# EAGLE design Syn-ShieldCarger-v04 (EAGLE 5.10)
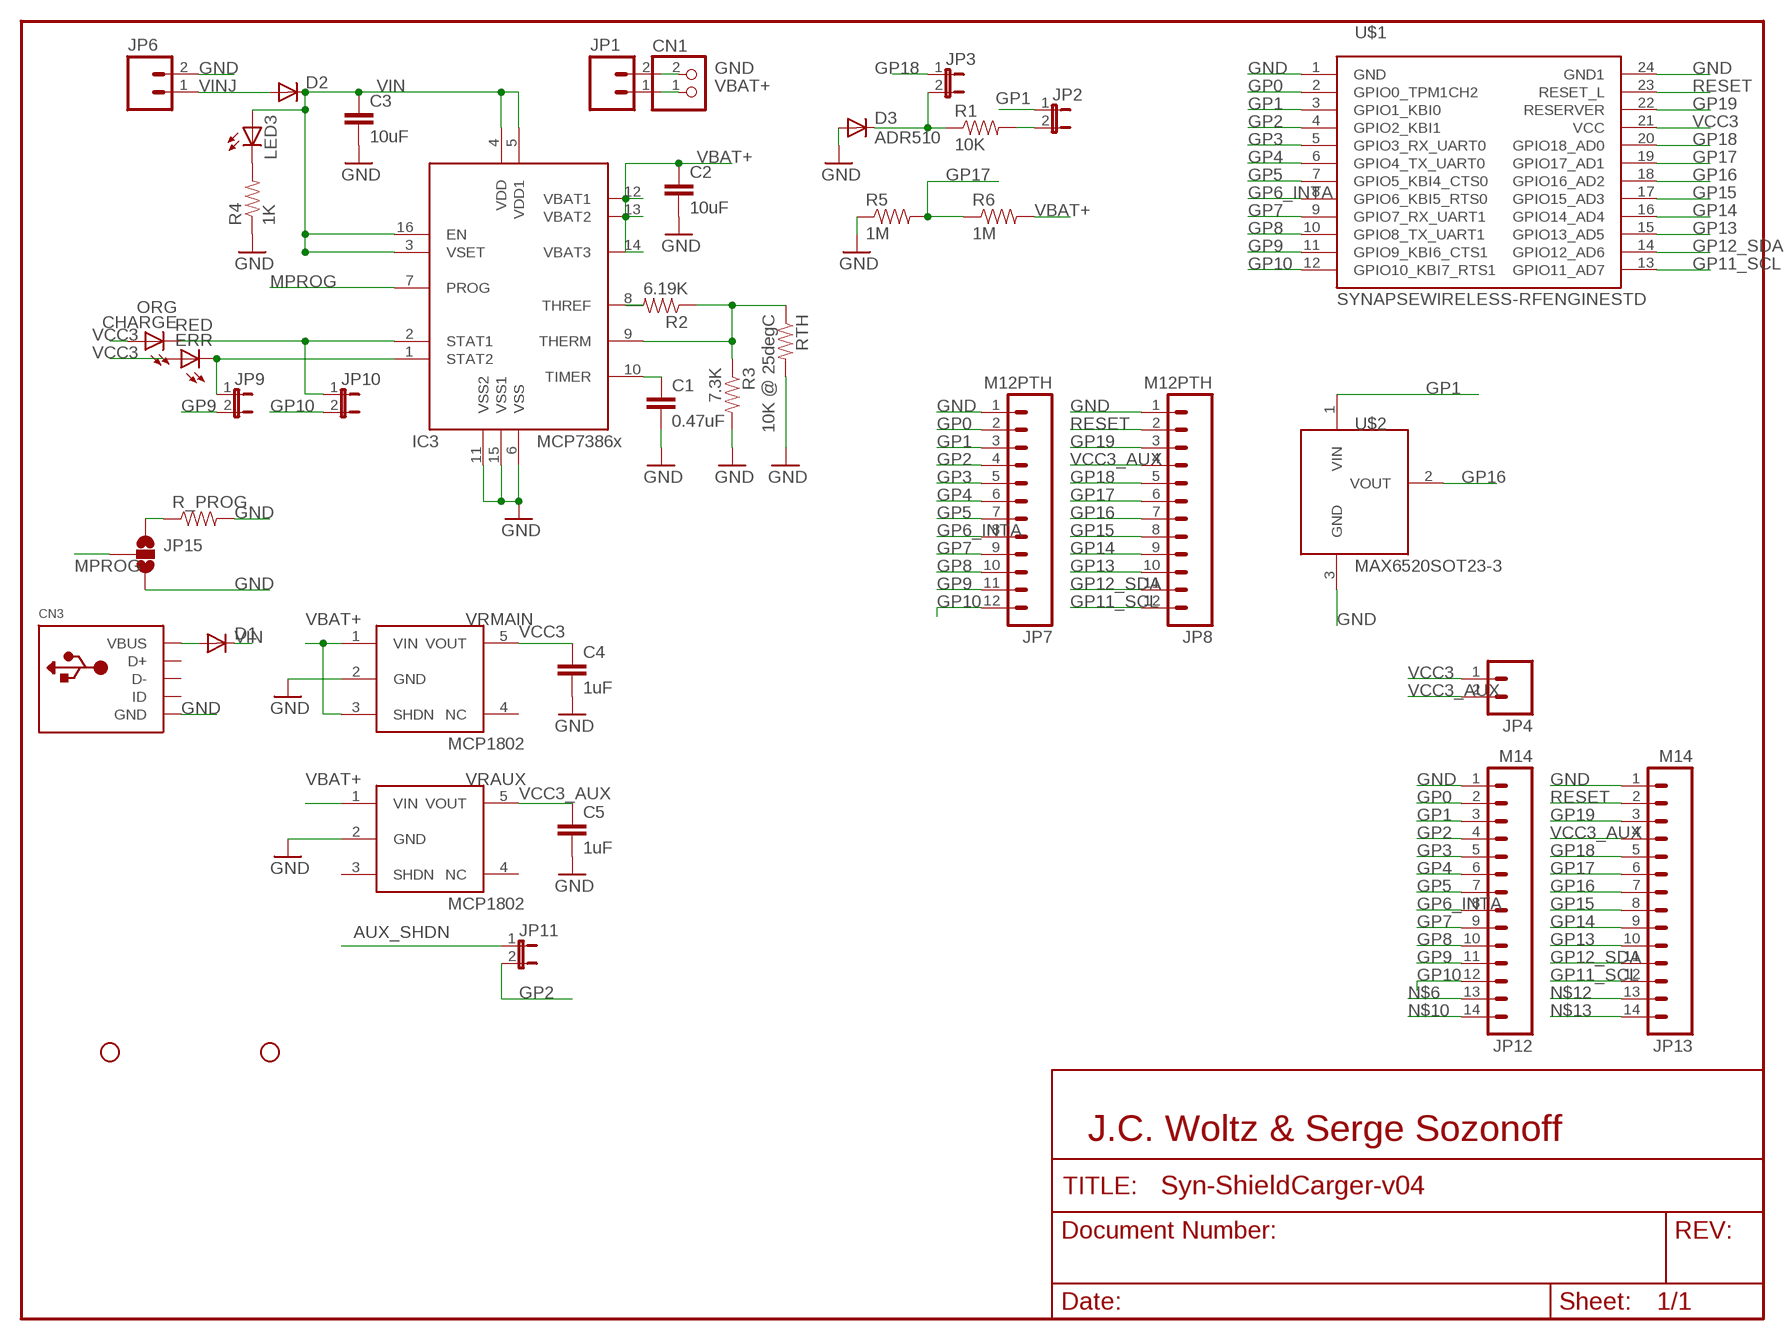
[diagram p0: schematic, sheet 1]

## Parts
C1  0.47uF  CAP0603-CAP  [0603-CAP]
C2  10uF  CAP1206  [1206]
C3  10uF  CAP1206  [1206]
C4  1uF  CAP0603-CAP  [0603-CAP]
C5  1uF  CAP0603-CAP  [0603-CAP]
CHARGE  ORG  LEDCHIPLED_0603  [CHIPLED_0603]
CN1  JST_2PIN-THM-RA  [JST-PH-2-THM-RA]
CN3  USBMINIB  [USB-MINIB]
D1  DIODESOD  [SOD-323]
D2  DIODESMA  [SMA-DIODE]
D3  ADR510  DIODESOT-23-3-ADR510  [SOT23-3]
ERR  RED  LEDCHIPLED_0603  [CHIPLED_0603]
IC3  MCP73861SO16  [SO16-150MIL]
JP1  M02PTH  [1X02]
JP2  JUMPER-2SMD-NC  [SJ_2S]
JP3  JUMPER-2SMD-NC  [SJ_2S]
JP4  M02PTH  [1X02]
JP5  STAND-OFF  [STAND-OFF]
JP6  M023.5MM  [SCREWTERMINAL-3.5MM-2]
JP7  M12PTH  [1X12]
JP8  M12PTH  [1X12]
JP9  JUMPER-2SMD-NC  [SJ_2S]
JP10  JUMPER-2SMD-NC  [SJ_2S]
JP11  JUMPER-2SMD-NC  [SJ_2S]
JP12  M14  [1X14]
JP13  M14  [1X14]
JP15  SOLDERJUMPER_2WAYT  [SJ_2]
JP17  STAND-OFF  [STAND-OFF]
LED3  LEDCHIPLED_0603  [CHIPLED_0603]
R1  10K  RESISTOR0603-RES  [0603-RES]
R2  6.19K  RESISTOR0603-RES  [0603-RES]
R3  7.3K  RESISTOR0603-RES  [0603-RES]
R4  1K  RESISTOR0603-RES  [0603-RES]
R5  1M  RESISTOR0603-RES  [0603-RES]
R6  1M  RESISTOR0603-RES  [0603-RES]
R_PROG  RESISTORAXIAL-0603  [AXIAL-0603]
RTH  10K @ 25degC  RESISTORAXIAL-0603  [AXIAL-0603]
U$1  SYNAPSEWIRELESS-RFENGINESTD  SYNAPSEWIRELESS-RFENGINESTDSTD  [SYNAPSERFENGINE]
U$2  MAX6520SOT23-3  [SOT23-3]
VRAUX  MCP1802  [SOT23-5]
VRMAIN  MCP1802  [SOT23-5]

## Nets
AUX_SHDN: JP11.1
GND: C1.2 C2.2 C3.2 C4.2 C5.2 CN1.2 CN3.GND D3.2(A) IC3.6(VSS) IC3.11(VSS2) IC3.15(VSS1) JP1.2 JP6.2 JP7.1 JP8.1 JP12.1 JP13.1 JP15.3 R3.2 R4.1 R5.1 R_PROG.P$2 RTH.P$2 U$1.1(GND) U$1.24(GND1) U$2.3(GND) VRAUX.2(GND) VRMAIN.2(GND)
GP0: JP7.2 JP12.2 U$1.2(GPIO0_TPM1CH2)
GP1: JP2.1 JP7.3 JP12.3 U$1.3(GPIO1_KBI0) U$2.1(VIN)
GP2: JP7.4 JP11.2 JP12.4 U$1.4(GPIO2_KBI1)
GP3: JP7.5 JP12.5 U$1.5(GPIO3_RX_UART0)
GP4: JP7.6 JP12.6 U$1.6(GPIO4_TX_UART0)
GP5: JP7.7 JP12.7 U$1.7(GPIO5_KBI4_CTS0)
GP6_INTA: JP7.8 JP12.8 U$1.8(GPIO6_KBI5_RTS0)
GP7: JP7.9 JP12.9 U$1.9(GPIO7_RX_UART1)
GP8: JP7.10 JP12.10 U$1.10(GPIO8_TX_UART1)
GP9: JP7.11 JP9.2 JP12.11 U$1.11(GPIO9_KBI6_CTS1)
GP10: JP7.12 JP10.2 JP12.12 U$1.12(GPIO10_KBI7_RTS1)
GP11_SCL: JP8.12 JP13.12 U$1.13(GPIO11_AD7)
GP12_SDA: JP8.11 JP13.11 U$1.14(GPIO12_AD6)
GP13: JP8.10 JP13.10 U$1.15(GPIO13_AD5)
GP14: JP8.9 JP13.9 U$1.16(GPIO14_AD4)
GP15: JP8.8 JP13.8 U$1.17(GPIO15_AD3)
GP16: JP8.7 JP13.7 U$1.18(GPIO16_AD2) U$2.2(VOUT)
GP17: JP8.6 JP13.6 R5.2 R6.1 U$1.19(GPIO17_AD1)
GP18: JP3.1 JP8.5 JP13.5 U$1.20(GPIO18_AD0)
GP19: JP8.3 JP13.3 U$1.22(RESERVER)
MPROG: IC3.7(PROG) JP15.2
N$2: LED3.C R4.2
N$3: D3.1(C) JP3.2 R1.1
N$4: JP2.2 R1.2
N$6: JP12.13
N$7: IC3.8(THREF) R2.2
N$8: IC3.9(THERM) R2.1 R3.1 RTH.P$1
N$9: C1.1 IC3.10(TIMER)
N$10: JP12.14
N$11: JP15.1 R_PROG.P$1
N$12: JP13.13
N$13: JP13.14
N$21: CN3.VBUS D1.2(A)
RESET: JP8.2 JP13.2 U$1.23(RESET_L)
STAT1: CHARGE.C IC3.2(STAT1) JP10.1
STAT2: ERR.C IC3.1(STAT2) JP9.1
VBAT+: C2.1 CN1.1 IC3.12(VBAT1) IC3.13(VBAT2) IC3.14(VBAT3) JP1.1 R6.2 VRAUX.1(VIN) VRMAIN.1(VIN) VRMAIN.3(SHDN)
VCC3: C4.1 CHARGE.A ERR.A JP4.1 U$1.21(VCC) VRMAIN.5(VOUT)
VCC3_AUX: C5.1 JP4.2 JP8.4 JP13.4 VRAUX.5(VOUT)
VIN: C3.1 D1.1(C) D2.C IC3.3(VSET) IC3.4(VDD) IC3.5(VDD1) IC3.16(EN) LED3.A
VINJ: D2.A JP6.1
Unconnected: CN3.D+ CN3.D- CN3.ID VRAUX.3(SHDN) VRAUX.4(NC) VRMAIN.4(NC)

## Notes on the sheet
- J.C. Woltz & Serge Sozonoff

## Library data of the parts
C1-C5 = SparkFun:CAP: Capacitor Standard 0603 ceramic capacitor, and 0.1" leaded capacitor.
CHARGE ERR LED3 = adafruit:LED: LED OSRAM: - CHIPLED LG R971, LG N971, LY N971, LG Q971, LY Q971, LO R971, LY R971 LH N974, LH R974 LS Q976, LO Q976, LY Q976 LO Q996 - Hyper CHIPLED LW Q18S LB Q993, LB Q99A, LB R99A - SideLED LS A670, LO A670, LY A670, LG A670, LP A670 LB A673, LV A673, LT A673, LW A673 LH A674 LY A675 LS A676, LA A676, LO A676, LY A676, LW A676 LS A679, LY A679, LG A679 - Hyper Micro SIDELED® LS Y876, LA Y876, LO Y876, LY Y876 LT Y87S - SmartLED LW L88C, LW L88S LB L89C, LB L89S, LG L890 LS L89K, LO L89K, LY L89K LS L896, LA L896, LO L896, LY L896 - TOPLED LS T670, LO T670, LY T670, LG T670, LP T670 LSG T670, LSP T670, LSY T670, LOP T670, LYG T670 LG T671, LOG T671, LSG T671 LB T673, LV T673, LT T673, LW T673 LH T674 LS T676, LA T676, LO T676, LY T676, LB T676, LH T676, LSB T676, LW T676 LB T67C, LV T67C, LT T67C, LS T67K, LO T67K, LY T67K, LW E67C LS E67B, LA E67B, LO E67B, LY E67B, LB E67C, LV E67C, LT E67C LW T67C LS T679, LY T679, LG T679 LS T770, LO T770, LY T770, LG T770, LP T770 LB T773, LV T773, LT T773, LW T773 LH T774 LS E675, LA E675, LY E675, LS T675 LS T776, LA T776, LO T776, LY T776, LB T776 LHGB T686 LT T68C, LB T68C - Hyper Mini TOPLED® LB M676 - Mini TOPLED Santana® LG M470 LS M47K, LO M47K, LY M47K Source: http://www.osram.convergy.de/
CN1 = adafruit:JST_2PIN: JST 2-Pin Connectors of various flavors SMT-RA (S2B-PH-SM4) 4UConnector #17311 SMT (B2B-PH-SM4) THM-RA (S2B-PH) THM (B2B-PH)
CN3 = adafruit:USB: USB Connectors USBMINIB - Surface Mount Female Mini-B USB Connector 4UConnector: 06564 By microbuilder.eu Thru-hole RA Female Mini-B USB Connector 4UConnector: 18732 By ladyada.net
D1 D2 = SparkFun:DIODE: Diode These are standard reverse protection diodes and small signal diodes. SMA package can handle up to about 1A. SOD-323 can handle about 200mA. What the SOD-323 package when ordering, there are some mfgs out there that are 5-pin packages.
D3 = 0_jc-modified:DIODE: Diode These are standard reverse protection diodes and small signal diodes. SMA package can handle up to about 1A. SOD-323 can handle about 200mA. What the SOD-323 package when ordering, there are some mfgs out there that are 5-pin packages.
IC3 = 0_jc-custom:MCP73861
JP1 JP4 JP6 = SparkFun:M02: Header 2 Standard 2-pin 0.1" header. Use with straight break away headers (SKU : PRT-00116), right angle break away headers (PRT-00553), swiss pins (PRT-00743), machine pins (PRT-00117), and female headers (PRT-00115). Molex polarized connector foot print use with SKU : PRT-08233 with associated crimp pins and housings.
JP2 JP3 JP9-JP11 = SparkFun:JUMPER-2: Jumper Basic 0.1" spaced jumper. Use with breakaway headers.
JP5 JP17 = SparkFun:STAND-OFF: Stand Off This is the mechanical footprint for a #4 phillips button head screw. Use the keepout ring to avoid running the screw head into surrounding components. SKU : PRT-00447
JP7 JP8 = SparkFun:M12: Header 12 Standard 12-pin 0.1" header. Use with straight break away headers (SKU : PRT-00116), right angle break away headers (PRT-00553), swiss pins (PRT-00743), machine pins (PRT-00117), and female headers (PRT-00115).
JP12 JP13 = SparkFun:M14: Header 14 Standard 14-pin 0.1" header. Use with straight break away headers (SKU : PRT-00116), right angle break away headers (PRT-00553), swiss pins (PRT-00743), machine pins (PRT-00117), and female headers (PRT-00115).
JP15 = SparkFun:SOLDERJUMPER_2WAY: Solder Jumper 2 way solder jumper
R1 R4-R6 = SparkFun:RESISTOR: Resistor Basic schematic elements and footprints for 0603, 1206, and PTH 1/10th watt (small) resistors.
R2 R3 R_PROG RTH = 0_jc-custom:RESISTOR
U$1 = 0_jc-custom:SYNAPSEWIRELESS-RFENGINE
U$2 = 0_jc-custom:MAX6520
VRAUX VRMAIN = 0_jc-modified:MCP1802

## Board
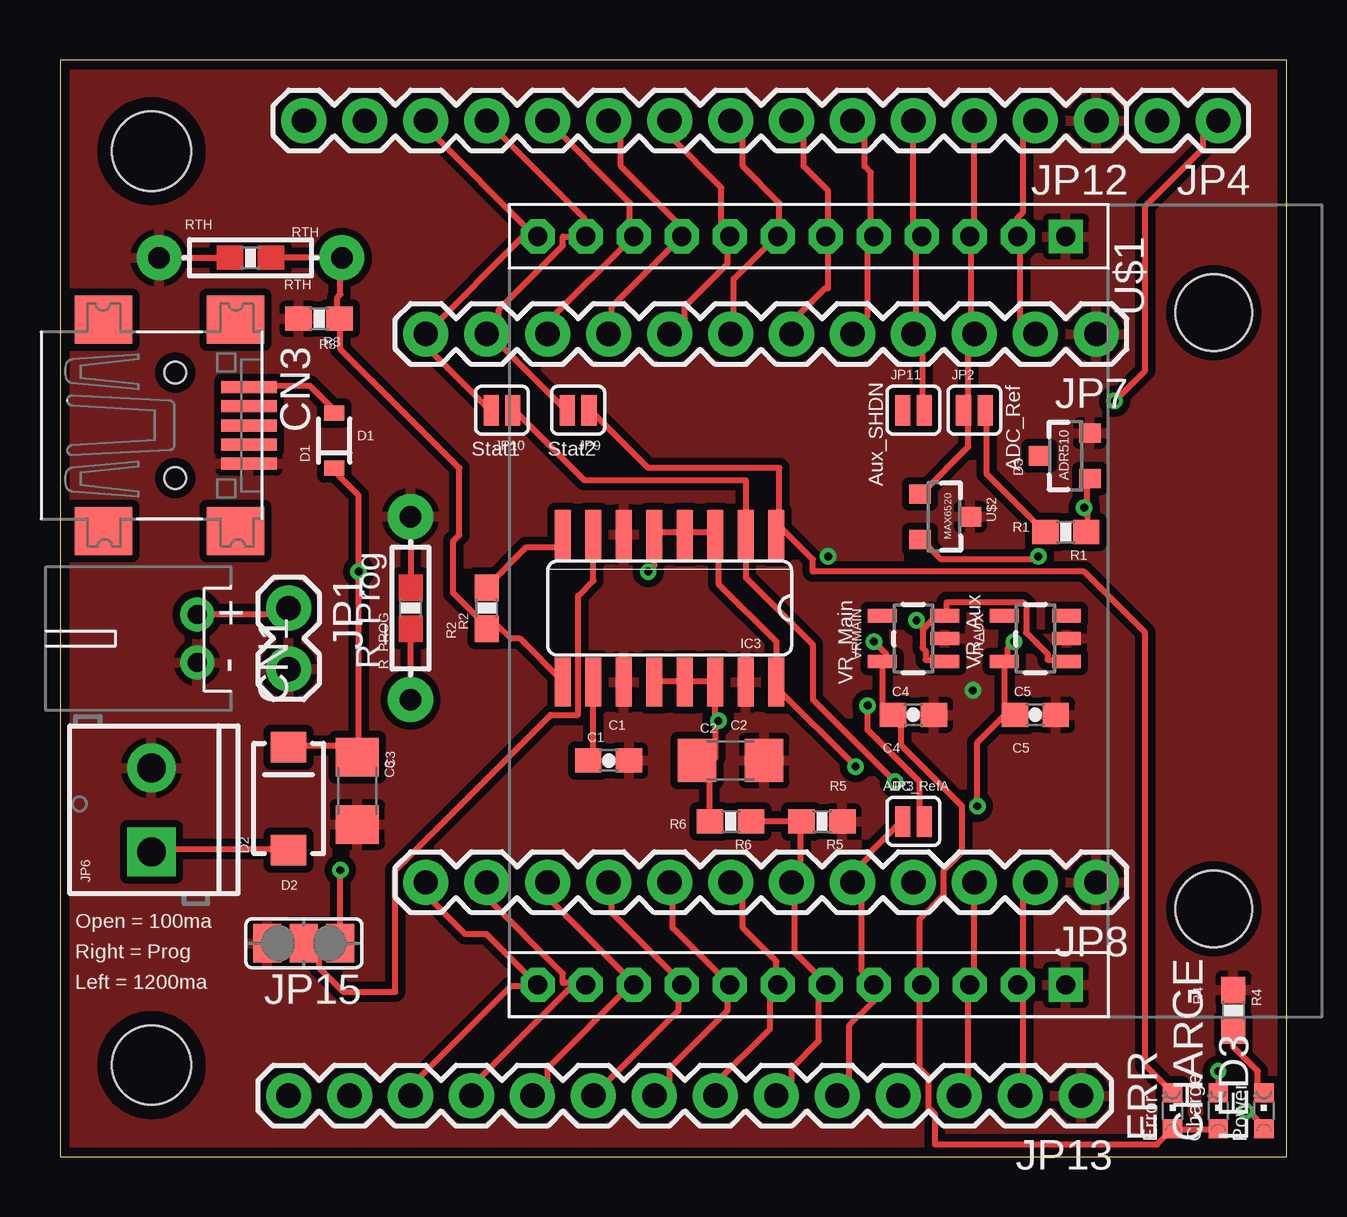
[diagram p1: board, top side]
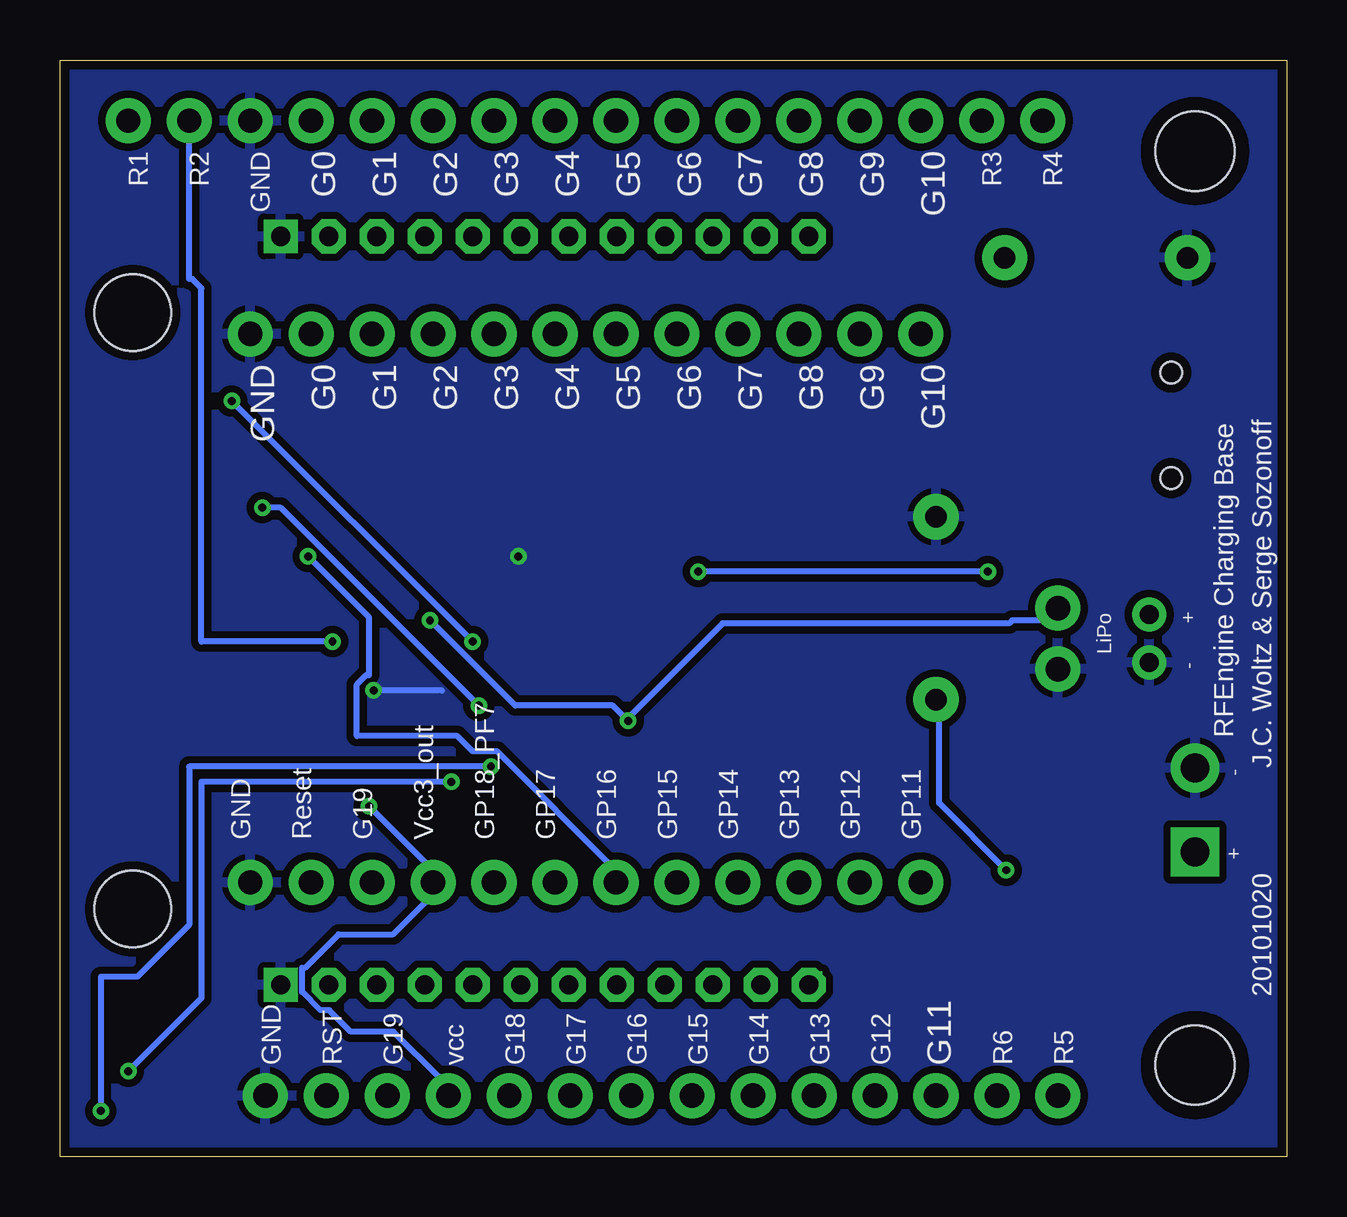
[diagram p2: board, bottom side, seen from below]

Size 51.1 x 45.71 mm. Coordinates in mm from the lower left corner, seen from the top.
Outline: 0,0 51.1,0 51.1,45.71 0,45.71 0,0
Copper layers (1*16): Top 0.0356mm / dielectric 1.5011mm / Bottom 0.0356mm
Design rules "LaenPCBOrder-JCModified": minimum track width 10mil, minimum drill 13mil, track to track 10mil, track to pad 6mil, pad to pad 6mil, via to via 6mil, smd to smd 6mil, copper to edge 15mil, drill to drill 6mil, minimum pad ring 12mil, minimum via ring 7mil, stop-mask expansion 4mil, vias tented up to drill 25mil, thermal gap 10mil

### Footprints (pad centres in the part's own frame; a part is rotated, then mirrored left to right if it is on the bottom)
0603-CAP = smd 1.1 x 1: 1 -0.85,0; 2 0.85,0
1206 = smd 1.6 x 1.8: 1 -1.4,0; 2 1.4,0
CHIPLED_0603 = smd 0.8 x 0.8: A 0,-0.75; C 0,0.75
JST-PH-2-THM-RA = drill 0.8 pad 1.422 round: 1 1,0; 2 -1,0
USB-MINIB = smd 0.5 x 2.308: D+ 0,4.064; D- -0.8,4.064; GND 1.6,4.064; ID 0.8,4.064; VBUS -1.6,4.064 | smd 2 x 2.4: GND1 -4.4,-2; GND2 -4.4,3.5; GND3 4.4,3.5; GND4 4.4,-2 | hole 0.9: -2.2,1; 2.2,1
SOD-323 = smd 0.63 x 0.83: 1 -1.15,0; 2 1.15,0
SMA-DIODE = smd 1.27 x 1.47: A -2.15,0; C 2.15,0
SOT23-3 = smd 0.8 x 0.9: 1 -0.95,-1; 2 0.95,-1; 3 0,1.1
SO16-150MIL = smd 0.66 x 2.032: 1 -4.445,-3.073; 2 -3.175,-3.073; 3 -1.905,-3.073; 4 -0.635,-3.073; 5 0.635,-3.073; 6 1.905,-3.073; 7 3.175,-3.073; 8 4.445,-3.073; 9 4.445,3.073; 10 3.175,3.073; 11 1.905,3.073; 12 0.635,3.073; 13 -0.635,3.073; 14 -1.905,3.073; 15 -3.175,3.073; 16 -4.445,3.073
1X02 = drill 1.016 pad 1.88 round: 1 0,0; 2 2.54,0
SJ_2S = smd 0.635 x 1.27: 1 -0.45,0; 2 0.45,0
STAND-OFF = hole 3.302: 0,0
SCREWTERMINAL-3.5MM-2 = drill 1.2 pad 2.032 square: 1 0,0 | drill 1.2 pad 2.032 round: 2 3.5,0
1X12 = drill 1.016 pad 1.88 round: 1 0,0; 2 2.54,0; 3 5.08,0; 4 7.62,0; 5 10.16,0; 6 12.7,0; 7 15.24,0; 8 17.78,0; 9 20.32,0; 10 22.86,0; 11 25.4,0; 12 27.94,0
1X14 = drill 1.016 pad 1.88 round: 1 0,0; 2 2.54,0; 3 5.08,0; 4 7.62,0; 5 10.16,0; 6 12.7,0; 7 15.24,0; 8 17.78,0; 9 20.32,0; 10 22.86,0; 11 25.4,0; 12 27.94,0; 13 30.48,0; 14 33.02,0
SJ_2 = smd 1.168 x 1.6: 1 -1.524,0; 2 0,0; 3 1.524,0
0603-RES = smd 1.1 x 1: 1 -0.85,0; 2 0.85,0
AXIAL-0603 = drill 0.9 pad 1.88 round: P$1 -3.81,0; P$2 3.81,0
SYNAPSERFENGINE = drill 0.8 square: 1 0,0; 24 31.2,0 | drill 0.8 pad 1.422 octagon: 2 0,-2; 3 0,-4; 4 0,-6; 5 0,-8; 6 0,-10; 7 0,-12; 8 0,-14; 9 0,-16; 10 0,-18; 11 0,-20; 12 0,-22; 13 31.2,-22; 14 31.2,-20; 15 31.2,-18; 16 31.2,-16; 17 31.2,-14; 18 31.2,-12; 19 31.2,-10; 20 31.2,-8; 21 31.2,-6; 22 31.2,-4; 23 31.2,-2 | hole 3.2: 3.17,6.16; 28.03,6.16
SOT23-5 = smd 0.55 x 1.2: 1 -0.95,-1.3; 2 0,-1.3; 3 0.95,-1.3; 4 0.95,1.3; 5 -0.95,1.3

### Placement (x,y rotation side)
C1  22.86,16.51 0 top
C2  27.94,16.51 0 top
C3  12.38,15.24 270 top
C4  35.56,18.41 0 top
C5  40.64,18.41 0 top
CHARGE  48.26,1.91 0 top
CN1  5.71,21.59 90 top
CN3  3.81,30.48 270 top
D1  11.43,29.84 90 top
D2  9.53,14.92 90 top
D3  41.91,29.21 90 top
ERR  46.35,1.91 0 top
IC3  25.4,22.86 180 top
JP1  9.53,22.86 270 top
JP2  38.1,31.11 0 top
JP3  35.56,13.97 0 top
JP4  48.26,43.18 180 top
JP5  3.81,41.91 0 top
JP6  3.81,12.7 90 top
JP7  43.18,34.29 180 top
JP8  43.18,11.43 180 top
JP9  21.59,31.11 180 top
JP10  18.41,31.11 180 top
JP11  35.56,31.11 0 top
JP12  43.18,43.18 180 top
JP13  42.55,2.54 180 top
JP15  10.16,8.89 180 top
JP17  3.81,3.81 0 top
LED3  50.16,1.91 0 top
R1  41.91,26.04 180 top
R2  17.78,22.86 90 top
R3  10.79,34.92 180 top
R4  48.9,6.1 270 top
R5  31.75,13.97 180 top
R6  27.94,13.97 180 top
R_PROG  14.61,22.86 90 top
RTH  7.94,37.47 180 top
U$1  41.91,38.35 270 top
U$2  36.83,26.67 270 top
VRAUX  40.64,21.59 90 top
VRMAIN  35.56,21.59 90 top

### Tracks (layer width: path | path; a pad name or v marks a point on that pad's centre or on a via)
GND  (via drill 0.33)
  Bottom 0.254: 35.18,19.43 v38.04,19.43
  other vias: 32,25.02
  pour Bottom (isolate 0.305): 0,45.72 50.8,45.72 50.8,0 0,0
  pour Top (isolate 0.305): 0,45.72 50.8,45.72 50.8,0 0,0
GP0
  Top 0.254: JP7.2 40.01,34.29 40.01,38.35 U$1.2 39.88,38.35 39.88,39.12 40.13,39.37 40.13,42.67 JP12.2
GP1
  Top 0.254: JP12.3 38.1,38.35 U$1.3 37.97,38.35 37.97,34.29 JP7.3 37.85,34.04 37.85,31.24 37.72,31.11 JP2.1 37.85,31.11 37.85,29.59 35.94,27.69 U$2.1
GP2
  Top 0.254: JP11.2 35.94,31.11 35.94,33.4 35.56,33.78 JP7.4 35.69,33.78 35.69,38.23 35.81,38.35 U$1.4 35.56,38.35 JP12.4
GP3
  Top 0.254: JP7.5 33.02,34.42 33.66,35.05 33.66,38.1 U$1.5 33.78,38.35 33.78,41.02 33.53,41.27 33.53,42.67 JP12.5
GP4
  Top 0.254: 32,38.35 32,36.2 31.88,36.2 30.48,34.8 JP7.6 | JP12.6 30.99,42.67 30.99,41.27 32,40.26 32,38.35 | 32,38.35 U$1.6
GP5
  Top 0.254: JP7.7 28.07,34.42 28.07,36.58 29.84,38.35 U$1.7 29.97,38.35 29.97,39.75 28.45,41.27 28.45,42.67 JP12.7
GP6_INTA
  Top 0.254: 27.81,38.35 27.56,38.61 27.56,40.39 25.4,42.55 JP12.8 | JP7.8 26.04,34.92 26.04,35.43 27.81,37.21 27.81,38.35 | 27.81,38.35 U$1.8
GP7
  Top 0.254: JP7.9 22.99,34.42 22.99,35.43 U$1.9 25.78,38.35 25.78,38.86 23.37,41.27 23.37,42.67 JP12.9
GP8
  Top 0.254: JP7.10 20.32,34.8 23.88,38.35 U$1.10 23.75,38.35 23.75,39.75 JP12.10
GP9
  Top 0.254: JP9.2 21.08,31.11 17.91,34.29 JP7.11 18.29,34.04 18.29,35.31 20.95,37.97 20.95,38.35 21.84,38.35 | JP12.11 21.84,39.12 21.84,38.35 | 21.84,38.35 U$1.11
GP10
  Top 0.254: JP10.2 17.91,31.11 15.24,33.78 JP7.12 19.43,38.48 19.43,38.61 U$1.12 19.81,38.35 15.24,42.93 JP12.12
GP11_SCL  (via drill 0.6)
  Top 0.254: v19.81,7.24 17.78,9.27 16.89,9.27 15.24,10.92 JP8.12 | JP13.12 14.61,3.3 14.99,3.3 18.8,7.11 19.81,7.11 U$1.13
  Bottom 0.254: U$1.13 v19.81,7.24
GP12_SDA
  Top 0.254: JP8.11 17.78,10.79 20.95,7.62 20.95,7.24 21.84,7.24 U$1.14 21.84,7.11 21.34,7.11 17.53,3.3 17.14,3.3 JP13.11
GP13
  Top 0.254: JP8.10 20.32,10.79 23.88,7.24 U$1.15 23.75,7.24 23.75,7.11 20.32,3.68 20.32,3.17 JP13.10
GP14
  Top 0.254: JP8.9 22.99,11.3 22.99,10.16 25.91,7.24 U$1.16 25.78,7.24 25.78,6.1 JP13.9
GP15
  Top 0.254: JP8.8 25.53,11.3 25.53,9.53 27.81,7.24 U$1.17 27.81,7.11 27.81,6.1 25.4,3.68 25.4,3.17 JP13.8
GP16  (via drill 0.33)
  Top 0.254: JP13.7 27.3,3.05 29.59,5.33 29.59,6.86 29.84,7.11 U$1.18 29.84,7.24 29.84,8.13 28.45,9.53 28.45,10.92 JP8.7 | v40.77,25.02 40.77,24.89 36.7,24.89 35.94,25.65 U$2.2
  Bottom 0.254: v40.77,25.02 38.23,22.48 38.23,20.07 38.35,20.07 38.73,19.68 38.73,17.53 34.54,17.53 33.91,16.89 32.89,16.89 27.94,11.94 JP8.7
GP17
  Top 0.254: 30.86,13.97 R6.1 | 30.86,13.97 30.86,12.32 30.48,11.94 JP8.6 30.61,11.94 30.61,8.51 31.88,7.24 U$1.19 31.62,7.37 31.62,4.83 30.48,3.68 30.48,3.17 JP13.6 | 30.86,13.97 R5.2
GP18
  Top 0.254: JP3.1 35.05,13.97 33.78,12.7 33.78,12.57 33.02,11.81 JP8.5 33.4,12.06 33.4,7.75 33.91,7.24 U$1.20 33.91,7.11 33.91,6.48 32.89,5.46 32.89,3.05 JP13.5
GP19
  Top 0.254: JP8.3 38.1,7.37 37.97,7.24 U$1.22 37.85,7.11 37.85,2.92 JP13.3
MPROG
  Top 0.254: JP15.2 10.79,8.26 10.79,7.87 11.81,6.86 13.97,6.86 13.97,11.94 20.45,18.41 21.59,18.41 21.59,23.37 22.23,24 IC3.7
N$2
  Top 0.254: LED3.C 49.91,2.92 49.91,3.56 48.9,4.57 R4.2
N$3  (via drill 0.33)
  Top 0.254: 42.8,27.05 42.8,26.04 R1.1 | 42.8,27.05 42.8,28.19 D3.1 | v33.66,18.8 33.66,17.78 35.81,15.62 35.81,14.1 35.94,13.97 JP3.2 | v42.67,27.05 42.8,27.05
  Bottom 0.254: v33.66,18.8 41.91,27.05 v42.67,27.05
N$4
  Top 0.254: R1.2 41.02,26.04 38.61,28.45 38.61,31.11 JP2.2
N$7
  Top 0.254: R2.2 17.78,23.75 19.43,25.4 20.95,25.4 IC3.8
N$8
  Top 0.254: IC3.9 20.95,19.81 19.18,21.59 18.8,21.59 18.16,22.23 17.78,22.23 R2.1 17.78,22.1 16.38,23.5 16.38,25.65 16.64,25.91 16.64,28.7 11.68,33.66 11.68,34.92 R3.1 11.56,34.92 11.56,35.81 11.68,35.94 11.68,37.47 RTH.P$1
N$9
  Top 0.254: C1.1 22.1,16.51 22.23,16.64 IC3.10
N$11  (via drill 0.33)
  Top 0.254: JP15.1 v11.68,11.94
  Bottom 0.254: v11.68,11.94 14.48,14.73 14.48,19.05 R_PROG.P$1
N$21
  Top 0.254: D1.2 11.43,31.11 10.41,32.13 7.87,32.13 CN3.VBUS
RESET
  Top 0.254: JP13.2 40.13,2.67 40.13,6.99 40.01,7.11 U$1.23 40.13,7.11 40.13,10.92 JP8.2
STAT1  (via drill 0.33)
  Top 0.254: v34.8,15.62 31.37,19.05 31.37,21.34 28.57,24.13 IC3.2 28.57,28.19 21.84,28.19 18.92,31.11 JP10.1 | v48.26,3.56 CHARGE.C
  Bottom 0.254: v48.26,3.56 45.21,6.6 45.21,15.62 v34.8,15.62
STAT2
  Top 0.254: 29.97,26.16 29.84,26.16 IC3.1 29.97,26.16 | 29.97,26.16 30.1,26.16 31.37,24.89 31.37,24.38 42.67,24.38 45.21,21.84 45.21,3.81 ERR.C | 29.97,26.16 29.97,28.7 24.51,28.7 22.1,31.11 JP9.1
VBAT+  (via drill 0.33)
  Top 0.254: JP1.1 9.53,22.61 5.71,22.61 CN1.1 | 36.01,22.04 36.45,22.48 36.83,22.48 VRMAIN.3 36.96,22.61 36.96,23.11 40.13,23.11 40.26,22.99 40.26,21.84 41.15,20.95 41.15,20.7 41.91,20.7 VRAUX.1 | 36.01,22.04 35.94,21.97 35.94,21.21 36.07,21.08 36.07,20.7 36.83,20.7 VRMAIN.1 | 26.04,19.81 24.77,19.81 IC3.12 | R6.2 27.05,13.97 27.05,16.51 C2.1 27.18,16.51 27.3,16.64 27.3,18.16 | 27.3,18.16 IC3.14 27.3,19.81 26.04,19.81 | 26.04,19.81 IC3.13 | v27.43,18.16 27.3,18.16 | v35.69,22.35 36.01,22.04
  Bottom 0.254: v35.69,22.35 32.13,18.8 28.07,18.8 v27.43,18.16 27.43,18.29 23.5,22.23 11.56,22.23 11.43,22.35 10.03,22.35 JP1.1
VCC3  (via drill 0.33)
  Top 0.254: 46.35,1.14 48.26,1.14 CHARGE.A | 46.35,1.14 45.72,0.51 36.45,0.51 36.45,1.78 36.2,2.03 36.2,3.3 35.81,3.68 35.81,7.11 U$1.21 35.81,7.24 35.81,9.91 36.83,10.92 36.83,11.94 37.59,12.7 37.59,14.61 35.05,17.14 35.05,18.16 34.8,18.41 C4.1 34.67,18.41 34.29,18.8 34.29,20.57 VRMAIN.5 34.42,20.57 34.42,20.95 v33.91,21.46 | 46.35,1.14 ERR.A | JP4.1 47.62,42.55 47.62,42.04 45.21,39.62 45.21,32.77 v43.94,31.5
  Bottom 0.254: v33.91,21.46 v43.94,31.5
VCC3_AUX  (via drill 0.33)
  Top 0.254: v38.23,14.61 38.23,17.27 39.5,18.54 C5.1 39.75,18.41 39.37,18.8 39.37,20.57 VRAUX.5 39.5,20.57 39.5,21.21 v39.75,21.46
  Bottom 0.254: v38.23,14.61 35.56,11.94 JP8.4 35.56,10.92 37.21,9.27 39.5,9.27 40.89,7.87 41.02,7.87 41.02,6.86 40.26,6.1 39.88,6.1 38.99,5.21 37.21,5.21 35.31,3.3 34.92,3.3 JP13.4 | JP4.2 45.72,36.58 45.59,36.58 45.21,36.2 45.21,21.46 v39.75,21.46
VIN  (via drill 0.33)
  Top 0.254: D1.1 11.43,28.57 12.45,27.56 v12.45,24.38 12.45,17.4 C3.1 12.32,17.27 12.32,17.14 9.53,17.14 D2.C | 26.04,26.04 24.77,26.04 IC3.5 24.77,24.64 v24.51,24.38 | 26.04,26.04 27.3,26.04 IC3.3 27.3,25.91 27.43,25.78 27.43,23.88 29.84,21.46 IC3.16 29.84,19.56 v33.15,16.26 | 26.04,26.04 IC3.4 | v49.4,1.91 49.53,1.91 50.16,1.27 LED3.A
  Bottom 0.254: v49.4,1.91 49.4,7.49 47.88,7.49 45.72,9.65 45.72,16.26 v33.15,16.26 | v12.45,24.38 v24.51,24.38
VINJ
  Top 0.254: JP6.1 3.81,12.83 9.53,12.83 D2.A

### Text on the board
tPlace: RTH | RTH | R3 | D1 | Stat1 | Stat2 | ADC_Ref | Aux_SHDN | ADR510 | MAX6520 | R1 | R2 | R_Prog | VR_Main | VR_Aux | C1 | C2 | C4 | C5 | C3 | R5 | ADC_RefA | R6 | D2 | Open = 100ma | Right = Prog | Left = 1200ma | R4 | Error | Charge | Power
bPlace: R4 | R3 | G10 | G9 | G8 | G7 | G6 | G5 | G4 | G3 | G2 | G1 | G0 | GND | R2 | R1 | G10 | G9 | G8 | G7 | G6 | G5 | G4 | G3 | G2 | G1 | G0 | GND | + | LiPo | - | RFEngine Charging Base | J.C. Woltz & Serge Sozonoff | - | GP11 | GP12 | GP13 | GP14 | GP15 | GP16 | GP17 | GP18_PF7 | Vcc3_out | G19 | Reset | GND | + | 20101020 | R5 | R6 | G11 | G12 | G13 | G14 | G15 | G16 | G17 | G18 | vcc | G19 | RST | GND